# Altium schematic sheet 云RD.SchDoc: PCBV1.2
size A2
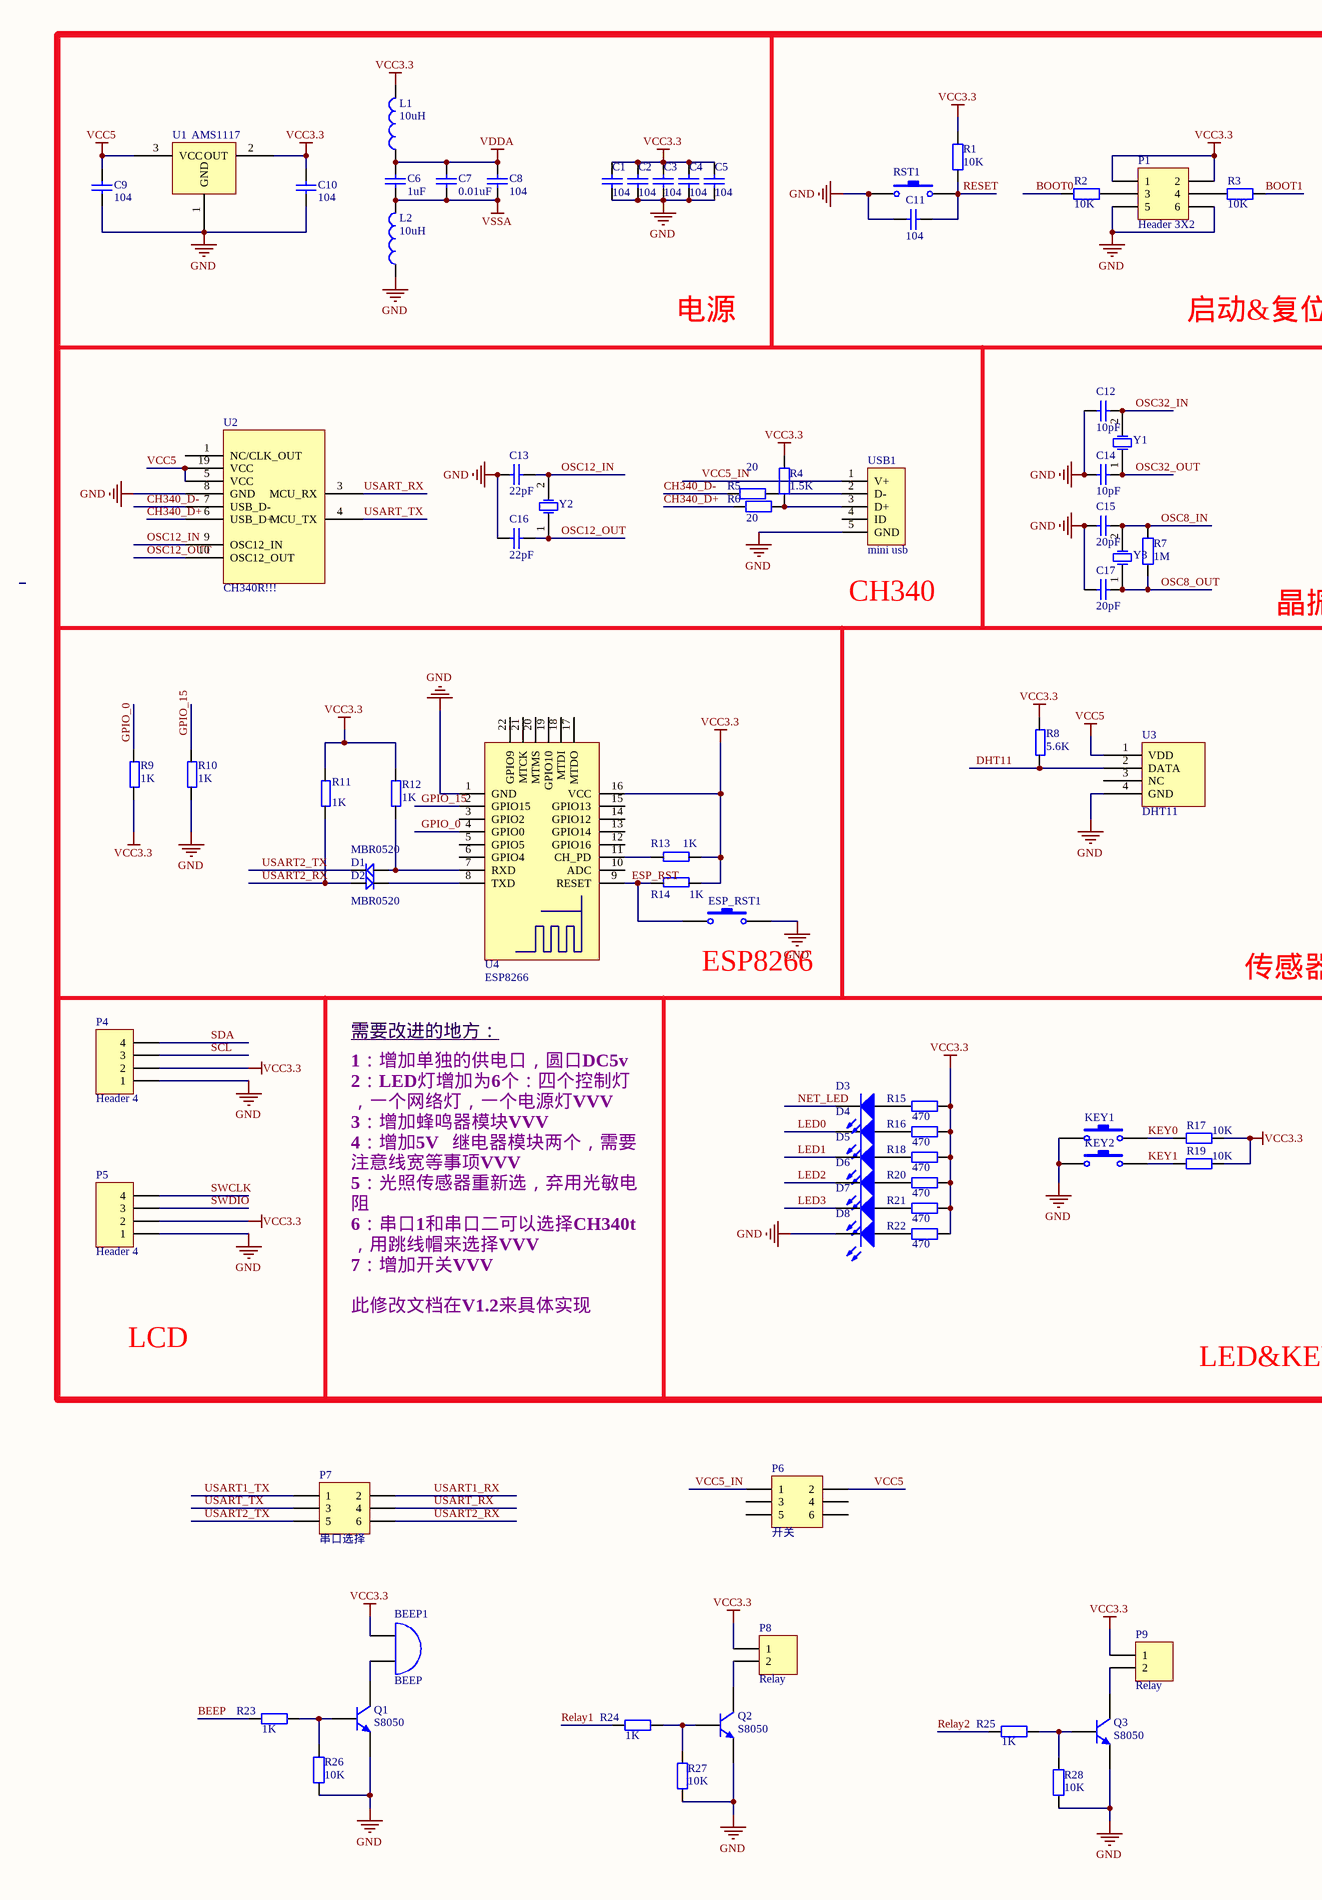
[diagram p0: 云RD.SchDoc, left]
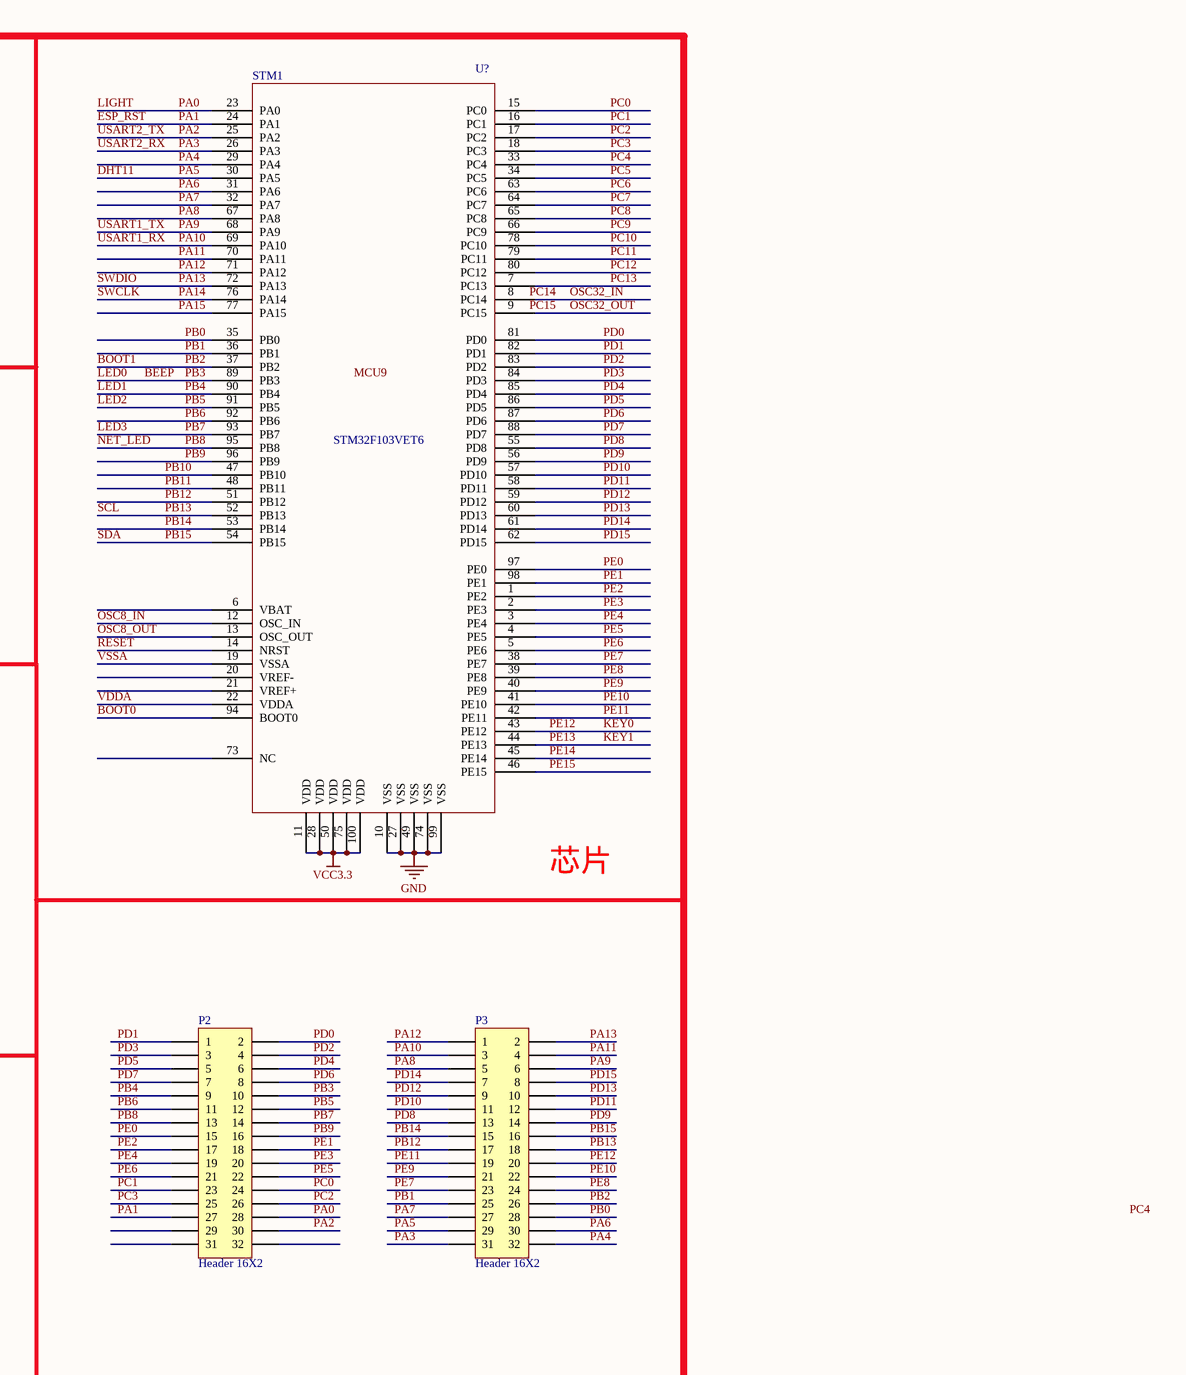
[diagram p1: 云RD.SchDoc, right]

## Parts
BEEP1  BEEP  [BEEP]
C1  value 104  [0805]  (hidden comment: Cap)
C2  value 104  [0805]  (hidden comment: Cap)
C3  value 104  [0805]  (hidden comment: Cap)
C4  value 104  [0805]  (hidden comment: Cap)
C5  value 104  [0805]  (hidden comment: Cap)
C6  value 1uF  [0805]  (hidden comment: Cap)
C7  value 0.01uF  [0805]  (hidden comment: Cap)
C8  value 104  [0805]  (hidden comment: Cap)
C9  value 104  [0805]  (hidden comment: Cap)
C10  value 104  [0805]  (hidden comment: Cap)
C11  value 104  [0805]  (hidden comment: Cap)
C12  value 10pF  [0805]  (hidden comment: Cap)
C13  value 22pF  [0805]  (hidden comment: Cap)
C14  value 10pF  [0805]  (hidden comment: Cap)
C15  value 20pF  [0805]  (hidden comment: Cap)
C16  value 22pF  [0805]  (hidden comment: Cap)
C17  value 20pF  [0805]  (hidden comment: Cap)
D1  MBR0520  [SOD-123]
D2  MBR0520  [SOD-123]
D3  LED1  [0805]  (value not drawn)
D4  LED1  [0805]  (value not drawn)
D5  LED1  [0805]  (value not drawn)
D6  LED1  [0805]  (value not drawn)
D7  LED1  [0805]  (value not drawn)
D8  LED1  [0805]  (value not drawn)
ESP_RST1  SW-PB  [PUSHSW]  (value not drawn)
KEY1  SW-PB  [PUSHSW]  (value not drawn)
KEY2  SW-PB  [PUSHSW]  (value not drawn)
L1  value 10uH  [0805]  (hidden comment: Inductor)
L2  value 10uH  [0805]  (hidden comment: Inductor)
P1  Header 3X2  [HDR2X3]
P2  Header 16X2  [HDR2X16]
P3  Header 16X2  [HDR2X16]
P4  Header 4  [0.96_OLED]
P5  Header 4  [HDR1X4]
P6  开关  [开关]
P7  串口选择  [HDR2X3]
P8  Relay  [BEEP]
P9  Relay  [BEEP]
Q1  S8050  [SOT-23]
Q2  S8050  [SOT-23]
Q3  S8050  [SOT-23]
R1  value 10K  [0805]  (hidden comment: Res2)
R2  value 10K  [0805]  (hidden comment: Res2)
R3  value 10K  [0805]  (hidden comment: Res2)
R4  value 1.5K  [0805]  (hidden comment: Res2)
R5  value 20  [0805]  (hidden comment: Res2)
R6  value 20  [0805]  (hidden comment: Res2)
R7  value 1M  [0805]  (hidden comment: Res2)
R8  5.6K  [0805]
R9  1K  [0805]
R10  1K  [0805]
R11  1K  [0805]
R12  1K  [0805]
R13  1K  [0805]
R14  1K  [0805]
R15  value 470  [0805]  (hidden comment: Res2)
R16  value 470  [0805]  (hidden comment: Res2)
R17  value 10K  [0805]  (hidden comment: Res2)
R18  value 470  [0805]  (hidden comment: Res2)
R19  value 10K  [0805]  (hidden comment: Res2)
R20  value 470  [0805]  (hidden comment: Res2)
R21  value 470  [0805]  (hidden comment: Res2)
R22  value 470  [0805]  (hidden comment: Res2)
R23  value 1K  [0805]  (hidden comment: Res2)
R24  value 1K  [0805]  (hidden comment: Res2)
R25  value 1K  [0805]  (hidden comment: Res2)
R26  value 10K  [0805]  (hidden comment: Res2)
R27  value 10K  [0805]  (hidden comment: Res2)
R28  value 10K  [0805]  (hidden comment: Res2)
RST1  SW-PB  [PUSHSW]  (value not drawn)
STM1  U?  [LQFP100]
U1  AMS1117  [SOT223]
U2  CH340R!!!  [ch340T]
U3  DHT11  [HDR1X4 - duplicate]
U4  ESP8266  [ESP8266]
USB1  mini usb  [MICRO-USB]
Y1  XTAL  [XTL]  (value not drawn)
Y2  XTAL  [XTAL5]  (value not drawn)
Y3  XTAL  [XTAL5]  (value not drawn)

## Nets
GND: C1.1 C2.1 C3.1 C4.1 C5.1 C9.1 C10.1 C11.1 C12.1 C13.1 C14.1 C15.1 C16.1 C17.1 D8.2(K) ESP_RST1.2 KEY1.1 KEY2.1 L2.1 P1.5 P1.6 P4.1 P5.1 Q1.3(E) Q2.3(E) Q3.3(E) R10.1 R26.2 R27.2 R28.2 RST1.2 STM1.10(VSS) STM1.27(VSS) STM1.49(VSS) STM1.74(VSS) STM1.99(VSS) U1.1(GND) U2.8(GND) U3.4(GND) U4.1(GND) USB1.5(GND)
VCC3.3: BEEP1.1(A) C1.2 C2.2 C3.2 C4.2 C5.2 C10.2 L1.2 P1.1 P1.2 P4.2 P5.2 P8.1 P9.1 R1.1 R4.2 R8.2 R9.1 R11.2 R12.2 R13.1 R14.1 R15.1 R16.1 R17.1 R18.1 R19.1 R20.1 R21.1 R22.1 STM1.11(VDD) STM1.28(VDD) STM1.50(VDD) STM1.75(VDD) STM1.100(VDD) U1.2(OUT) U4.16(VCC)
VCC5: C9.2 P6.2 U1.3(VCC) U2.5(VCC) U2.19(VCC) U3.1(VDD)
VDDA: C6.1 C7.1 C8.2 L1.1 STM1.22(VDDA)
VSSA: C6.2 C7.2 C8.1 L2.2 STM1.19(VSSA)
BEEP: D4.2(K) P2.10 R23.2 STM1.89(PB3)  [also labelled LED0, PB3]
BOOT0: R2.1 STM1.94(BOOT0)
BOOT1: P3.26 R3.2 STM1.37(PB2)  [also labelled PB2]
CH340_D+: R6.2 U2.6(USB_D+)
CH340_D-: R5.2 U2.7(USB_D-)
DHT11: P3.29 R8.1 STM1.30(PA5) U3.2(DATA)  [also labelled PA5]
ESP_RST: ESP_RST1.1 P2.27 R14.2 STM1.24(PA1) U4.9(RESET)  [also labelled PA1]
GPIO_0: R9.2 U4.4(GPIO0)
GPIO_15: R10.2 U4.2(GPIO15)
KEY0: KEY1.2 P3.20 R17.2 STM1.43(PE12)  [also labelled PE12]
KEY1: KEY2.2 R19.2 STM1.44(PE13)  [also labelled PE13]
LED1: D5.2(K) P2.9 STM1.90(PB4)  [also labelled PB4]
LED2: D6.2(K) P2.12 STM1.91(PB5)  [also labelled PB5]
LED3: D7.2(K) P2.14 STM1.93(PB7)  [also labelled PB7]
LIGHT: P2.28 STM1.23(PA0)  [also labelled PA0]
NET_LED: D3.2(K) P2.13 STM1.95(PB8)  [also labelled PB8]
OSC8_IN: C15.2 R7.2 STM1.12(OSC_IN) Y3.2(OSC2)
OSC8_OUT: C17.2 R7.1 STM1.13(OSC_OUT) Y3.1(OSC1)
OSC12_IN: C13.2 U2.9(OSC12_IN) Y2.2(OSC2)
OSC12_OUT: C16.2 U2.10(OSC12_OUT) Y2.1(OSC1)
OSC32_IN: C12.2 STM1.8(PC14) Y1.2(OSC2)
OSC32_OUT: C14.2 STM1.9(PC15) Y1.1(OSC1)
PA2: D1.2 P2.30 P7.5 STM1.25(PA2)  [also labelled USART2_TX]
PA3: D2.1 P3.31 P7.6 R11.1 STM1.26(PA3)  [also labelled USART2_RX]
PA4: P3.32 STM1.29(PA4)
PA6: P3.30 STM1.31(PA6)
PA7: P3.27 STM1.32(PA7)
PA8: P3.5 STM1.67(PA8)
PA9: P3.6 P7.1 STM1.68(PA9)  [also labelled USART1_TX]
PA10: P3.3 P7.2 STM1.69(PA10)  [also labelled USART1_RX]
PA11: P3.4 STM1.70(PA11)
PA12: P3.1 STM1.71(PA12)
PA13: P3.2 P5.3 STM1.72(PA13)  [also labelled SWDIO]
PA14: P5.4 STM1.76(PA14)  [also labelled SWCLK]
PA15: STM1.77(PA15)
PB0: P3.28 STM1.35(PB0)
PB1: P3.25 STM1.36(PB1)
PB6: P2.11 STM1.92(PB6)
PB9: P2.16 STM1.96(PB9)
PB10: STM1.47(PB10)
PB11: STM1.48(PB11)
PB12: P3.17 STM1.51(PB12)
PB13: P3.18 P4.3 STM1.52(PB13)  [also labelled SCL]
PB14: P3.15 STM1.53(PB14)
PB15: P3.16 P4.4 STM1.54(PB15)  [also labelled SDA]
PC0: P2.24 STM1.15(PC0)
PC1: P2.23 STM1.16(PC1)
PC2: P2.26 STM1.17(PC2)
PC3: P2.25 STM1.18(PC3)
PC4: STM1.33(PC4)
PC5: STM1.34(PC5)
PC6: STM1.63(PC6)
PC7: STM1.64(PC7)
PC8: STM1.65(PC8)
PC9: STM1.66(PC9)
PC10: STM1.78(PC10)
PC11: STM1.79(PC11)
PC12: STM1.80(PC12)
PC13: STM1.7(PC13)
PD0: P2.2 STM1.81(PD0)
PD1: P2.1 STM1.82(PD1)
PD2: P2.4 STM1.83(PD2)
PD3: P2.3 STM1.84(PD3)
PD4: P2.6 STM1.85(PD4)
PD5: P2.5 STM1.86(PD5)
PD6: P2.8 STM1.87(PD6)
PD7: P2.7 STM1.88(PD7)
PD8: P3.13 STM1.55(PD8)
PD9: P3.14 STM1.56(PD9)
PD10: P3.11 STM1.57(PD10)
PD11: P3.12 STM1.58(PD11)
PD12: P3.9 STM1.59(PD12)
PD13: P3.10 STM1.60(PD13)
PD14: P3.7 STM1.61(PD14)
PD15: P3.8 STM1.62(PD15)
PE0: P2.15 STM1.97(PE0)
PE1: P2.18 STM1.98(PE1)
PE2: P2.17 STM1.1(PE2)
PE3: P2.20 STM1.2(PE3)
PE4: P2.19 STM1.3(PE4)
PE5: P2.22 STM1.4(PE5)
PE6: P2.21 STM1.5(PE6)
PE7: P3.23 STM1.38(PE7)
PE8: P3.24 STM1.39(PE8)
PE9: P3.21 STM1.40(PE9)
PE10: P3.22 STM1.41(PE10)
PE11: P3.19 STM1.42(PE11)
PE14: STM1.45(PE14)
PE15: STM1.46(PE15)
Relay1: R24.2
Relay2: R25.2
RESET: C11.2 R1.2 RST1.1 STM1.14(NRST)
USART_RX: P7.4 U2.3(MCU_RX)
USART_TX: P7.3 U2.4(MCU_TX)
VCC5_IN: P6.1 USB1.1(V+)
NetBEEP1_2: BEEP1.2(B) Q1.1(C)
NetD1_1: D1.1 R12.1 U4.7(RXD)
NetD2_2: D2.2 U4.8(TXD)
NetD3_1: D3.1(A) R15.2
NetD4_1: D4.1(A) R16.2
NetD5_1: D5.1(A) R18.2
NetD6_1: D6.1(A) R20.2
NetD7_1: D7.1(A) R21.2
NetD8_1: D8.1(A) R22.2
NetP1_3: P1.3 R2.2
NetP1_4: P1.4 R3.1
NetP8_2: P8.2 Q2.1(C)
NetP9_2: P9.2 Q3.1(C)
NetQ1_2: Q1.2(B) R23.1 R26.1
NetQ2_2: Q2.2(B) R24.1 R27.1
NetQ3_2: Q3.2(B) R25.1 R28.1
NetR4_1: R4.1 R6.1 USB1.3(D+)
NetR5_1: R5.1 USB1.2(D-)
NetR13_2: R13.2 U4.11(CH_PD)

Not connected (* = marked no-connect by the designer): P2 29 31 32; P6 3 4 5 6; STM1 6(VBAT) 20(VREF-) 21(VREF+) 73(NC); U2 1(NC/CLK_OUT); U3 3(NC); U4 3(GPIO2) 5(GPIO5) 6(GPIO4) 10(ADC) 12(GPIO16) 13(GPIO14) 14(GPIO12) 15(GPIO13) 17(MTDO) 18(MTDI) 19(GPIO10) 20(MTMS) 21(MTCK) 22(GPIO9); USB1 4(ID)

## Notes on the sheet
- 电源
- 启动&复位
- (near USB1) CH340
- 晶振
- 芯片
- (near ESP_RST1) ESP8266
- 传感器
- 需要改进的地方：
- LCD
- 1：增加单独的供电口，圆口DC5v
  2：LED灯增加为6个：四个控制灯，一个网络灯，一个电源灯VVV
  3：增加蜂鸣器模块VVV
  4：增加5V   继电器模块两个，需要注意线宽等事项VVV
  5：光照传感器重新选，弃用光敏电阻
  6：串口1和串口二可以选择CH340t，用跳线帽来选择VVV
  7：增加开关VVV
  此修改文档在V1.2来具体实现
- LED&KEY
- Labels drawn without touching a wire or pin: MCU9, PC4, PC14, PC15
- Title
- Size:
- Date:
- File:
- A2
- Number:
- Time:
- Revision:
- Sheet
- of
- (in symbol STM32f103VET6) STM32F103VET6

## Library data of the parts
BEEP1 = Bell: Electrical Bell; Published: 24-Mar-1999; LatestRevisionDate: 17-Jul-2002; LatestRevisionNote: Re-released for DXP Platform.; PackageReference: PIN2; Publisher: Altium Limited
C1-C17 = Cap: Capacitor; Published: 8-Jun-2000; LatestRevisionDate: 17-Jul-2002; LatestRevisionNote: Re-released for DXP Platform.; PackageReference: RAD-0.3; Publisher: Altium Limited
D1 D2 = D: 1N4148
D3-D8 = LED1: Typical RED GaAs LED; Published: 8-Jun-2000; LatestRevisionDate: 08-Jul-2005; LatestRevisionNote: Mech Layer 1 removed.; PackageReference: LED-1; Publisher: Altium Limited
ESP_RST1 KEY1 KEY2 RST1 = SW-PB: Switch; Published: 24-Mar-1999; LatestRevisionDate: 17-Jul-2002; LatestRevisionNote: Re-released for DXP Platform.; PackageReference: SPST-2; Publisher: Altium Limited
L1 L2 = Inductor: Code_IEC: 1005; Published: 8-Jun-2000; LatestRevisionDate: 29-May-2009; LatestRevisionNote: IPC-7351 Footprint Added.; PackageReference: 0402-A; Publisher: Altium Limited; PackageDescription: Chip Inductor; Code_JEITA: 0402
P1 P6 P7 = Header 3X2: Header, 3-Pin, Dual row; LatestRevisionDate: 17-Jul-2002; LatestRevisionNote: Re-released for DXP Platform.; Publisher: Altium Limited
P2 P3 = Header 16X2: Header, 16-Pin, Dual row; LatestRevisionDate: 17-Jul-2002; LatestRevisionNote: Re-released for DXP Platform.; Publisher: Altium Limited
P4 P5 = Header 4: Header, 4-Pin; LatestRevisionDate: 17-Jul-2002; LatestRevisionNote: Re-released for DXP Platform.; Publisher: Altium Limited
P8 P9 = Header 2: Header, 2-Pin; LatestRevisionDate: 17-Jul-2002; LatestRevisionNote: Re-released for DXP Platform.; Publisher: Altium Limited
Q1-Q3 = NPN: NPN Bipolar Transistor; Published: 8-Jun-2000; LatestRevisionDate: 17-Jul-2002; LatestRevisionNote: Re-released for DXP Platform.; PackageReference: TO-226-AA; Publisher: Altium Limited; PackageDescription: TO, Flat Index; 3 In-Line, Axial Leads; Body Dia. 4.8mm; Leads 0.55 x 0.51 mm (max); Code_JEDEC: TO-226-AA
R1-R7 R15-R28 = Res2: Resistor; Published: 8-Jun-2000; LatestRevisionDate: 17-Jul-2002; LatestRevisionNote: Re-released for DXP Platform.; PackageReference: AXIAL-0.4; Publisher: Altium Limited
R8-R14 = R
STM1 = STM32f103VET6
U1 = AMS
U2 = CH340
Y1-Y3 = XTAL: Crystal Oscillator; Published: 8-Jun-2000; LatestRevisionDate: 17-Jul-2002; LatestRevisionNote: Re-released for DXP Platform.; PackageReference: R38; Publisher: Altium Limited